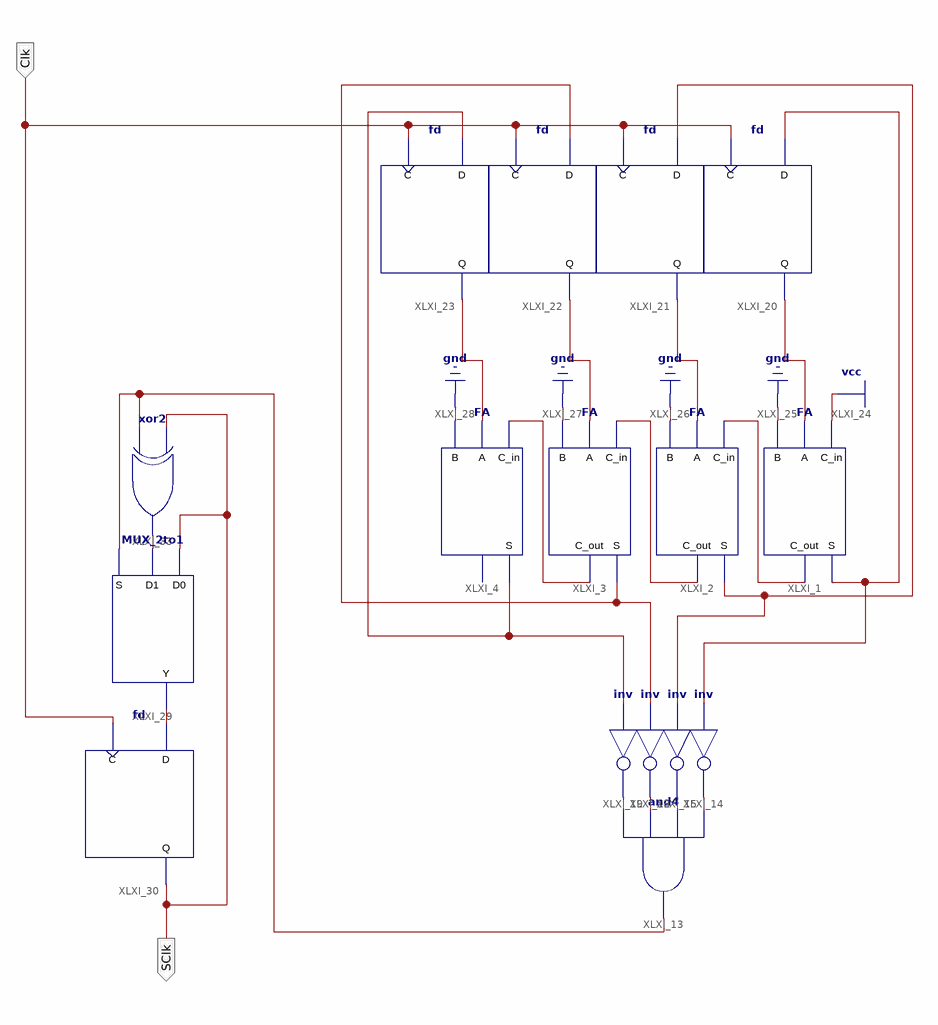
[diagram p0: schematic sheet 1]
// Xilinx ISE schematic Clock_Slow.sch (spartan3e) as structural Verilog: 16 symbols, 2 ports
module Clock_Slow (
  input  Clk,
  output SClk
);

  wire XLXN_1, XLXN_2, XLXN_3, XLXN_65, XLXN_66, XLXN_67, XLXN_68, XLXN_69, XLXN_70, XLXN_71, XLXN_72,
       XLXN_76, XLXN_77, XLXN_78, XLXN_79, XLXN_93, XLXN_97, ZERO;

  FA XLXI_1 (.A(XLXN_69), .B(1'b0), .C_in(1'b1), .C_out(XLXN_1), .S(XLXN_78));
  FA XLXI_2 (.A(XLXN_70), .B(1'b0), .C_in(XLXN_1), .C_out(XLXN_2), .S(XLXN_79));
  FA XLXI_3 (.A(XLXN_71), .B(1'b0), .C_in(XLXN_2), .C_out(XLXN_3), .S(XLXN_76));
  FA XLXI_4 (.A(XLXN_72), .B(1'b0), .C_in(XLXN_3), .S(XLXN_77));  // open: C_out
  and XLXI_13 (ZERO, XLXN_68, XLXN_67, XLXN_66, XLXN_65);
  not XLXI_14 (XLXN_65, XLXN_78);
  not XLXI_15 (XLXN_66, XLXN_79);
  not XLXI_18 (XLXN_67, XLXN_76);
  not XLXI_19 (XLXN_68, XLXN_77);
  fd XLXI_20 (.C(Clk), .D(XLXN_78), .Q(XLXN_69));
  fd XLXI_21 (.C(Clk), .D(XLXN_79), .Q(XLXN_70));
  fd XLXI_22 (.C(Clk), .D(XLXN_76), .Q(XLXN_71));
  fd XLXI_23 (.C(Clk), .D(XLXN_77), .Q(XLXN_72));
  fd XLXI_30 (.C(Clk), .D(XLXN_93), .Q(SClk));
  MUX_2to1 XLXI_29 (.D0(SClk), .S(ZERO), .D1(XLXN_97), .Y(XLXN_93));
  xor XLXI_33 (XLXN_97, ZERO, SClk);
endmodule
